# EAGLE design Small (EAGLE 6.6.0)
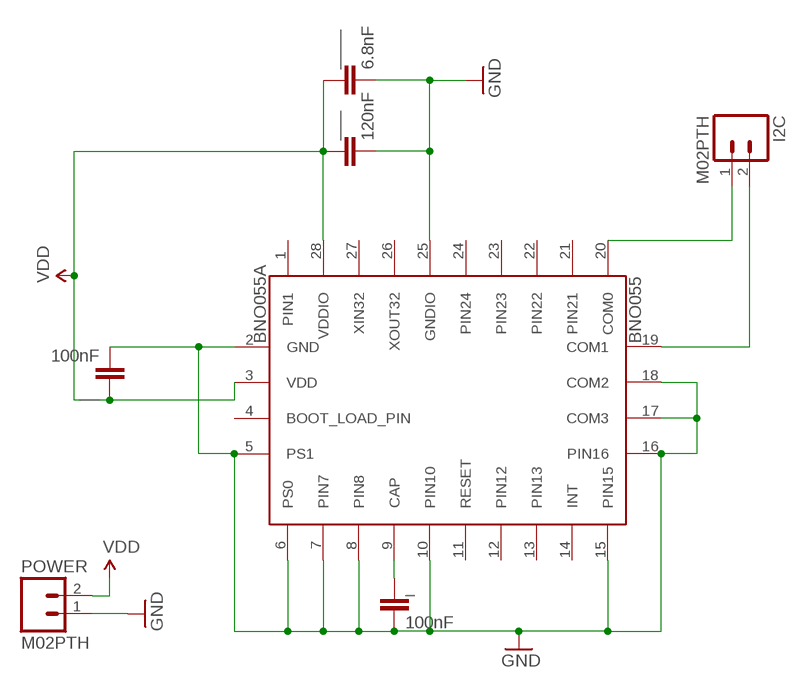
[diagram p0: schematic, sheet 1]

## Parts
_  100nF  CAP1206  [1206]
__  100nF  CAP1206  [1206]
___  120nF  CAP1206  [1206]
____  6.8nF  CAP1206  [1206]
BNO055  BNO055A  [BNO055]
I2C  M02PTH  [1X02]
POWER  M02PTH  [1X02]

## Nets
GND: _.2 __.2 ___.2 ____.2 BNO055.2(GND) BNO055.5(PS1) BNO055.6(PS0) BNO055.7(PIN7) BNO055.8(PIN8) BNO055.10(PIN10) BNO055.15(PIN15) BNO055.16(PIN16) BNO055.17(COM3) BNO055.18(COM2) BNO055.25(GNDIO) POWER.1
N$1: _.1 BNO055.9(CAP)
SCL: BNO055.19(COM1) I2C.2
SDA: BNO055.20(COM0) I2C.1
VDD: __.1 ___.1 ____.1 BNO055.3(VDD) BNO055.28(VDDIO) POWER.2
Unconnected: BNO055.1(PIN1) BNO055.4(BOOT_LOAD_PIN) BNO055.11(RESET) BNO055.12(PIN12) BNO055.13(PIN13) BNO055.14(INT) BNO055.21(PIN21) BNO055.22(PIN22) BNO055.23(PIN23) BNO055.24(PIN24) BNO055.26(XOUT32) BNO055.27(XIN32)

## Library data of the parts
_ __ ___ ____ = SparkFun-Capacitors:CAP: Capacitor Standard 0603 ceramic capacitor, and 0.1" leaded capacitor.
BNO055 = BNO055:BNO055
I2C POWER = SparkFun-Connectors:M02: Standard 2-pin 0.1" header. Use with - straight break away headers ( PRT-00116) - right angle break away headers (PRT-00553) - swiss pins (PRT-00743) - machine pins (PRT-00117) - female headers (PRT-00115) Molex polarized connector foot print use with: PRT-08233 with associated crimp pins and housings. 2.54_SCREWTERM for use with PRT-10571. 3.5mm Screw Terminal footprints for PRT-08084 5mm Screw Terminal footprints for use with PRT-08433

## Board
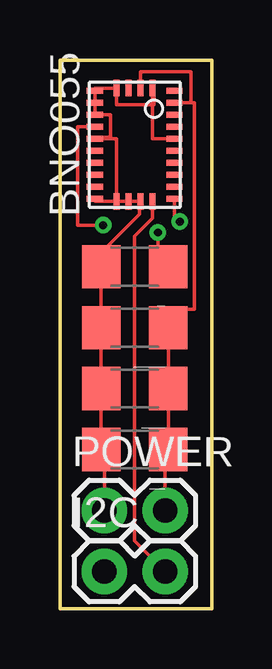
[diagram p1: board, top side]
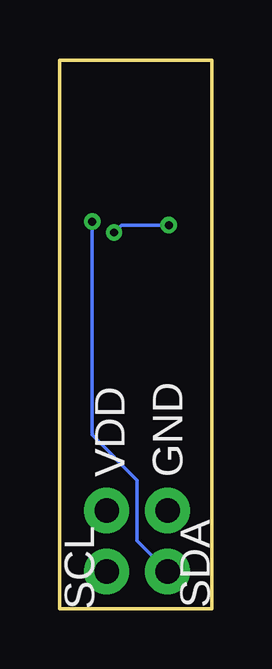
[diagram p2: board, bottom side, seen from below]

Size 6.35 x 22.86 mm. Coordinates in mm from the lower left corner, seen from the top.
Outline: 0,22.86 6.35,22.86 6.35,0 0,0 0,22.86
Copper layers (1*16): Top 0.0356mm / dielectric 1.5011mm / Bottom 0.0356mm
Design rules "LaenPCBOrder": minimum track width 6mil, minimum drill 13mil, track to track 6mil, track to pad 6mil, pad to pad 6mil, via to via 6mil, smd to smd 6mil, copper to edge 15mil, drill to drill 6mil, minimum pad ring 7mil, minimum via ring 7mil, stop-mask expansion 3mil, vias tented up to drill 0mil, thermal gap 10mil

### Footprints (pad centres in the part's own frame; a part is rotated, then mirrored left to right if it is on the bottom)
1206 = smd 1.6 x 1.8: 1 -1.4,0; 2 1.4,0
BNO055 = smd 0.675 x 0.25: 1 1.663,2.25; 6 -1.665,2.25; 7 -1.665,1.75; 8 -1.665,1.25; 9 -1.665,0.75; 10 -1.665,0.25; 11 -1.665,-0.25; 12 -1.665,-0.75; 13 -1.665,-1.25; 14 -1.665,-1.75; 15 -1.665,-2.25; 20 1.663,-2.25; 21 1.663,-1.75; 22 1.663,-1.25; 23 1.663,-0.75; 24 1.663,-0.25; 25 1.663,0.25; 26 1.663,0.75; 27 1.663,1.25; 28 1.663,1.75 | smd 0.25 x 0.675: 2 0.75,2.362; 3 0.25,2.362; 4 -0.25,2.362; 5 -0.75,2.362; 16 -0.75,-2.362; 17 -0.25,-2.362; 18 0.25,-2.362; 19 0.75,-2.362
1X02 = drill 1.016 pad 1.88: 1 0,0; 2 2.54,0

### Placement (x,y rotation side)
_  3.12,14.25 180 top
__  3.12,6.63 180 top
___  3.12,9.17 180 top
____  3.12,11.71 180 top
BNO055  3.12,19.33 0 top
I2C  1.85,1.55 0 top
POWER  1.85,4.09 0 top

### Tracks (layer width: path | path; a pad name or v marks a point on that pad's centre or on a via)
GND
  Top 0.152: BNO055.15 1.46,16.97 BNO055.16 | BNO055.25 3.87,19.58 BNO055.2 3.94,21.69 3.94,21.01 2.37,21.01 BNO055.5 1.46,21.69 BNO055.6 BNO055.7 BNO055.8 2.11,20.58 2.11,19.63 1.46,19.63 BNO055.10 2.37,19.58 BNO055.16 | POWER.1 1.85,6.5 1.72,6.5 __.2 ___.2 ____.2 _.2 1.72,14.83 3.33,16.43 3.33,16.92 BNO055.18 BNO055.17 BNO055.16
N$1  (via drill 0.33)
  Top 0.152: BNO055.9 0.74,20.08 0.74,15.98 v1.8,15.98 | v4.09,15.67 4.09,14.68 _.1
  Bottom 0.152: v1.8,15.98 3.78,15.98 v4.09,15.67
SCL
  Top 0.152: BNO055.19 3.87,16.27 3.12,15.52 3.12,2.82 I2C.2
SDA  (via drill 0.33)
  Top 0.152: BNO055.20 4.79,16.35 v5,16.13
  Bottom 0.152: v5,16.13 5,7.24 3.12,5.36 3.12,2.82 I2C.1
VDD
  Top 0.152: POWER.2 4.39,6.63 __.1 ___.1 ____.1 4.52,12.47 5.61,12.47 5.61,21.08 BNO055.28 5.46,21.08 5.46,22.38 3.37,22.38 BNO055.3

### Text on the board
bPlace: GND | VDD | SCL | SDA